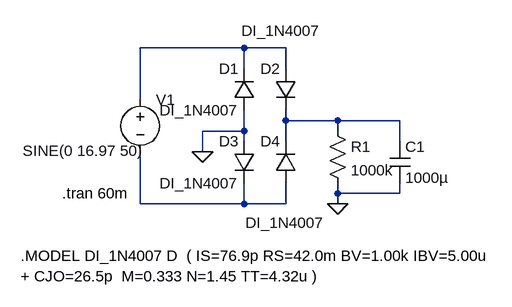
[diagram p0: schematic sim_RectifV1.asc]
sim_RectifV1.asc, the LTspice schematic file:
Version 4.1
SHEET 1 1236 680
WIRE 288 16 128 16
WIRE 352 16 288 16
WIRE 288 48 288 16
WIRE 352 48 352 16
WIRE 128 96 128 16
WIRE 352 128 352 112
WIRE 432 128 352 128
WIRE 528 128 432 128
WIRE 288 144 288 112
WIRE 288 144 224 144
WIRE 432 144 432 128
WIRE 288 160 288 144
WIRE 352 160 352 128
WIRE 528 160 528 128
WIRE 224 176 224 144
WIRE 432 240 432 224
WIRE 528 240 528 224
WIRE 528 240 432 240
WIRE 128 256 128 176
WIRE 288 256 288 224
WIRE 288 256 128 256
WIRE 352 256 352 224
WIRE 352 256 288 256
WIRE 432 256 432 240
FLAG 224 176 0
FLAG 432 256 0
SYMBOL voltage 128 80 R0
WINDOW 3 -181 94 Left 2
WINDOW 123 0 0 Left 0
WINDOW 39 0 0 Left 0
SYMATTR Value SINE(0 16.97 50)
SYMATTR InstName V1
SYMBOL res 416 128 R0
SYMATTR InstName R1
SYMATTR Value 1000k
SYMBOL diode 304 112 R180
WINDOW 0 24 64 Left 2
WINDOW 3 24 0 Left 2
SYMATTR InstName D1
SYMATTR Value DI_1N4007
SYMBOL diode 368 48 M0
WINDOW 3 -38 -58 Left 2
SYMATTR Value DI_1N4007
SYMATTR InstName D2
SYMBOL diode 304 160 M0
SYMATTR InstName D3
SYMATTR Value DI_1N4007
SYMBOL diode 368 224 R180
WINDOW 0 24 64 Left 2
WINDOW 3 -44 -61 Left 2
SYMATTR InstName D4
SYMATTR Value DI_1N4007
SYMBOL cap 512 160 R0
SYMATTR InstName C1
SYMATTR Value 1000µ
TEXT 8 240 Left 2 !.tran 60m
TEXT -56 336 Left 2 !.MODEL DI_1N4007 D  ( IS=76.9p RS=42.0m BV=1.00k IBV=5.00u\n+ CJO=26.5p  M=0.333 N=1.45 TT=4.32u )

The netlist it stands for:
* sim_RectifV1.asc
V1 N001 N003 SINE(0 16.97 50)
R1 N002 0 1000k
D1 0 N001 DI_1N4007
D2 N001 N002 DI_1N4007
D3 0 N003 DI_1N4007
D4 N003 N002 DI_1N4007
C1 N002 0 1000µ
.model D D
.lib standard.dio
.tran 60m
.MODEL DI_1N4007 D  ( IS=76.9p RS=42.0m BV=1.00k IBV=5.00u
+ CJO=26.5p  M=0.333 N=1.45 TT=4.32u )
.backanno
.end